# Altium schematic sheet LTC2373_Schematic.SchDoc
size A; SheetNumber: 4; SheetTotal: 4
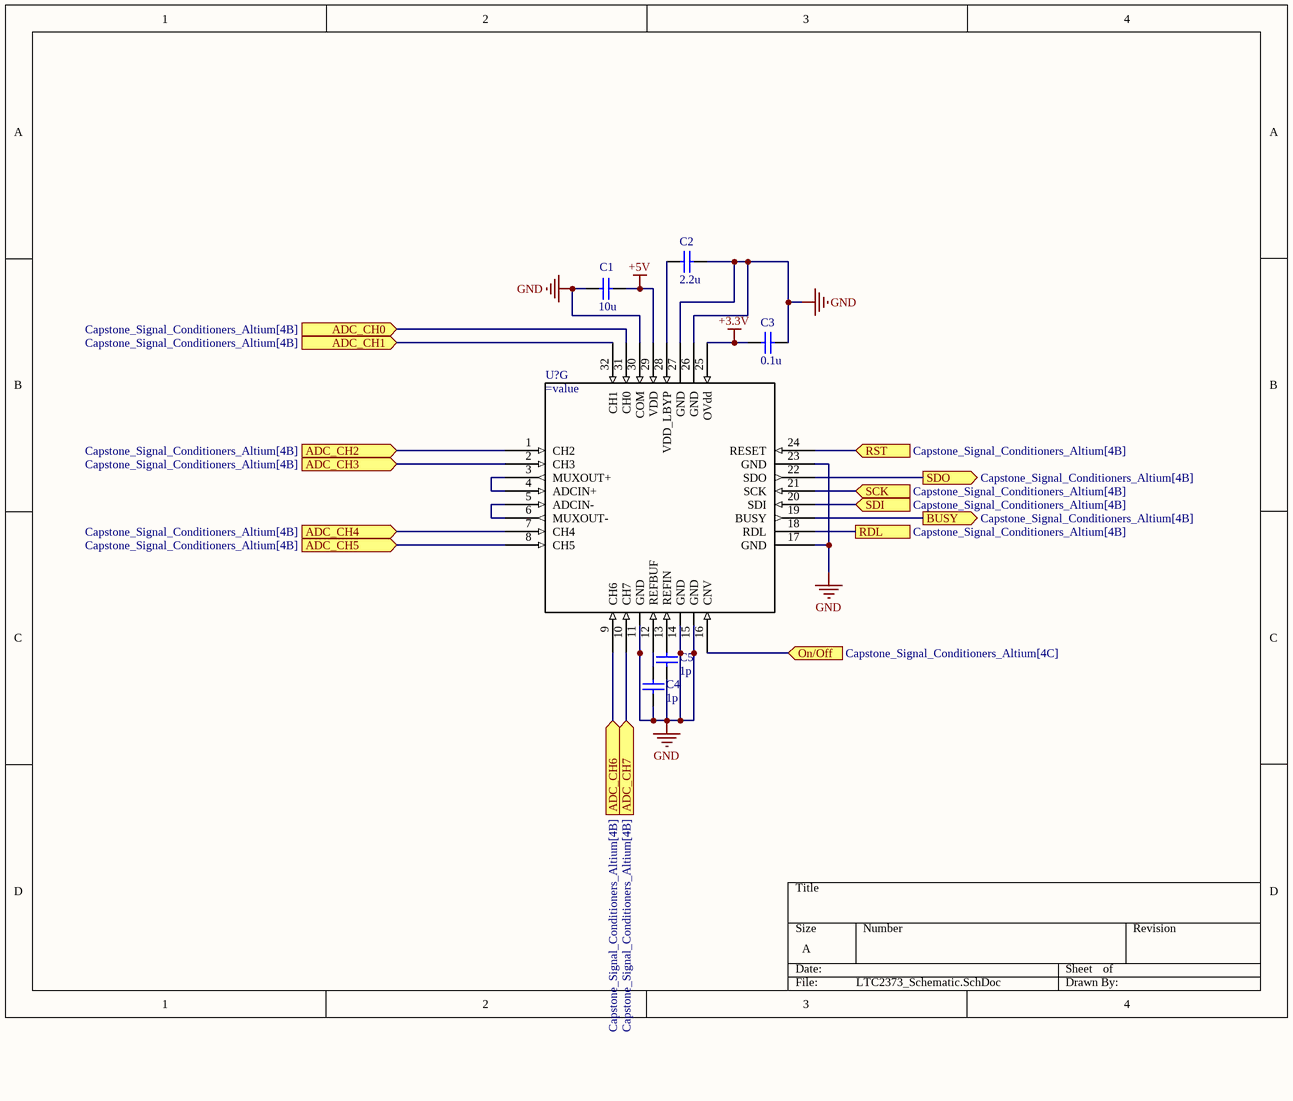
[diagram p0: LTC2373_Schematic.SchDoc]

## Parts
C1  value 10u  (hidden comment: Capacitor)
C2  value 2.2u  (hidden comment: Capacitor)
C3  value 0.1u  (hidden comment: Capacitor)
C4  value 1p  (hidden comment: Capacitor)
C5  value 1p  (hidden comment: Capacitor)
U?  (no value)  (part G of 7)

## Ports
ADC_CH0 (in, see Capstone_Signal_Conditioners_Altium[4B]), ADC_CH1 (in, see Capstone_Signal_Conditioners_Altium[4B]), ADC_CH2 (in, see Capstone_Signal_Conditioners_Altium[4B]), ADC_CH3 (in, see Capstone_Signal_Conditioners_Altium[4B]), ADC_CH4 (in, see Capstone_Signal_Conditioners_Altium[4B]), ADC_CH5 (in, see Capstone_Signal_Conditioners_Altium[4B]), ADC_CH6 (in, see Capstone_Signal_Conditioners_Altium[4B]), ADC_CH7 (in, see Capstone_Signal_Conditioners_Altium[4B]), BUSY (out, see Capstone_Signal_Conditioners_Altium[4B]), On/Off (in, see Capstone_Signal_Conditioners_Altium[4C]), RDL (see Capstone_Signal_Conditioners_Altium[4B]), RST (in, see Capstone_Signal_Conditioners_Altium[4B]), SCK (in, see Capstone_Signal_Conditioners_Altium[4B]), SDI (in, see Capstone_Signal_Conditioners_Altium[4B]), SDO (out, see Capstone_Signal_Conditioners_Altium[4B])

## Nets
+3.3V: C3.1 U?.25(OVdd)
+5V: C1.1 U?.29(VDD)
GND: C1.2 C2.2 C3.2 C4.1 C5.1 U?.11(GND) U?.14(GND) U?.15(GND) U?.17(GND) U?.23(GND) U?.26(GND) U?.27(GND) U?.30(COM)
ADC_CH0: U?.31(CH0) ; port ADC_CH0
ADC_CH1: U?.32(CH1) ; port ADC_CH1
ADC_CH2: U?.1(CH2) ; port ADC_CH2
ADC_CH3: U?.2(CH3) ; port ADC_CH3
ADC_CH4: U?.7(CH4) ; port ADC_CH4
ADC_CH5: U?.8(CH5) ; port ADC_CH5
ADC_CH6: U?.9(CH6) ; port ADC_CH6
ADC_CH7: U?.10(CH7) ; port ADC_CH7
BUSY: U?.19(BUSY) ; port BUSY
On/Off: U?.16(CNV) ; port On/Off
RDL: U?.18(RDL) ; port RDL
RST: U?.24(RESET) ; port RST
SCK: U?.21(SCK) ; port SCK
SDI: U?.20(SDI) ; port SDI
SDO: U?.22(SDO) ; port SDO
NetC2_1: C2.1 U?.28(VDD_LBYP)
NetC4_2: C4.2 U?.12(REFBUF)
NetU?_3: U?.3(MUXOUT+) U?.4(ADCIN+)
NetU?_5: U?.5(ADCIN-) U?.6(MUXOUT-)

Not connected (* = marked no-connect by the designer): C5 2; U? 13(REFIN)

## Library data of the parts
C1-C5 = Capacitor: SimulationGenericComponent: True
U? = LTC2372ICU-16#PBF